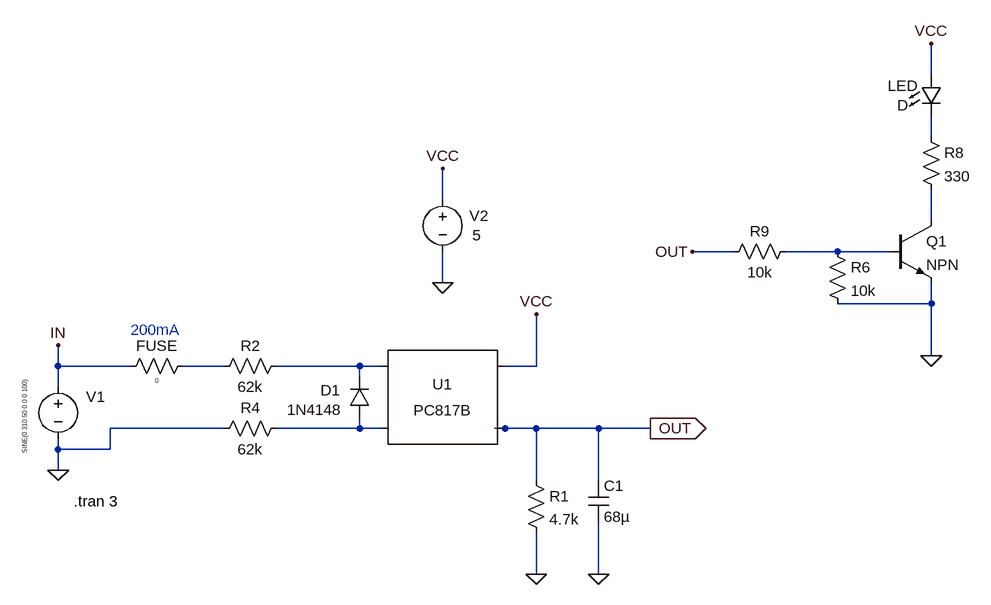
[diagram p0: schematic v1.2.asc]
v1.2.asc, the LTspice schematic file:
Version 4.1
SHEET 1 1060 680
WIRE 976 -320 976 -368
WIRE 976 -224 976 -256
WIRE 224 -128 224 -176
WIRE 976 -96 976 -144
WIRE 672 -48 608 -48
WIRE 832 -48 752 -48
WIRE 912 -48 832 -48
WIRE 224 0 224 -48
WIRE 976 32 976 0
WIRE 976 32 832 32
WIRE 976 112 976 32
WIRE -368 128 -368 96
WIRE -256 128 -368 128
WIRE -112 128 -176 128
WIRE 96 128 -32 128
WIRE 128 128 96 128
WIRE 368 128 368 48
WIRE 368 128 320 128
WIRE 96 144 96 128
WIRE -368 160 -368 128
WIRE -112 224 -288 224
WIRE 96 224 96 208
WIRE 96 224 -32 224
WIRE 128 224 96 224
WIRE 320 224 304 224
WIRE 368 224 320 224
WIRE 464 224 368 224
WIRE 544 224 464 224
WIRE -368 256 -368 240
WIRE -288 256 -288 224
WIRE -288 256 -368 256
WIRE -368 288 -368 256
WIRE 368 304 368 224
WIRE 464 304 464 224
WIRE 368 448 368 384
WIRE 464 448 464 368
FLAG -368 288 0
FLAG 224 0 0
FLAG 544 224 OUT
IOPIN 544 224 Out
FLAG -368 96 IN
FLAG 368 448 0
FLAG 224 -176 VCC
FLAG 368 48 VCC
FLAG 464 448 0
FLAG 976 112 0
FLAG 976 -368 VCC
FLAG 608 -48 OUT
SYMBOL Optos\\PC817B 224 176 R0
SYMATTR InstName U1
SYMBOL res 352 288 R0
SYMATTR InstName R1
SYMATTR Value 4.7k
SYMBOL voltage -368 144 R0
WINDOW 123 0 0 Left 0
WINDOW 39 0 0 Left 0
WINDOW 0 43 31 Left 2
WINDOW 3 -51 4 VRight 0
SYMATTR InstName V1
SYMATTR Value SINE(0 310 50 0 0 0 100)
SYMBOL res -16 112 R90
WINDOW 0 0 56 VBottom 2
WINDOW 3 32 56 VTop 2
SYMATTR InstName R2
SYMATTR Value 62k
SYMBOL voltage 224 -144 R0
WINDOW 123 0 0 Left 0
WINDOW 39 0 0 Left 0
WINDOW 0 41 41 Left 2
WINDOW 3 46 71 Left 2
SYMATTR InstName V2
SYMATTR Value 5
SYMBOL res -160 112 R90
WINDOW 0 0 56 VBottom 2
WINDOW 3 32 56 VTop 0
SYMATTR InstName FUSE
SYMATTR Value 0
SYMBOL res -16 208 R90
WINDOW 0 0 56 VBottom 2
WINDOW 3 32 56 VTop 2
SYMATTR InstName R4
SYMATTR Value 62k
SYMBOL diode 112 208 R180
WINDOW 0 45 43 Left 2
WINDOW 3 43 13 Left 2
SYMATTR InstName D1
SYMATTR Value 1N4148
SYMBOL cap 448 304 R0
SYMATTR InstName C1
SYMATTR Value 68µ
SYMBOL npn 912 -96 R0
SYMATTR InstName Q1
SYMBOL res 816 -64 R0
SYMATTR InstName R6
SYMATTR Value 10k
SYMBOL res 960 -240 R0
SYMATTR InstName R8
SYMATTR Value 330
SYMBOL res 768 -64 R90
WINDOW 0 0 56 VBottom 2
WINDOW 3 32 56 VTop 2
SYMATTR InstName R9
SYMATTR Value 10k
SYMBOL LED 960 -320 R0
WINDOW 0 -51 17 Left 2
WINDOW 3 -36 47 Left 2
SYMATTR InstName LED
TEXT -344 336 Left 2 !.tran 3
TEXT -256 72 Left 2 ;200mA

The netlist it stands for:
* v1.2.asc
X§U1 N005 N006 VCC OUT PC817 Igain=1.5m
R1 OUT 0 4.7k
V1 IN 0 SINE(0 310 50 0 0 0 100)
R2 N005 N004 62k
V2 VCC 0 5
R§FUSE N004 IN 0
R4 N006 0 62k
D1 N006 N005 1N4148
C1 OUT 0 68µ
Q1 N002 N003 0 0 NPN
R6 N003 0 10k
R8 N001 N002 330
R9 N003 OUT 10k
D§LED VCC N001 D
.model D D
.lib standard.dio
.model NPN NPN
.model PNP PNP
.lib standard.bjt
.tran 3
* 200mA
.lib PC817.sub
.backanno
.end